# EAGLE design untitled (EAGLE 5.06)
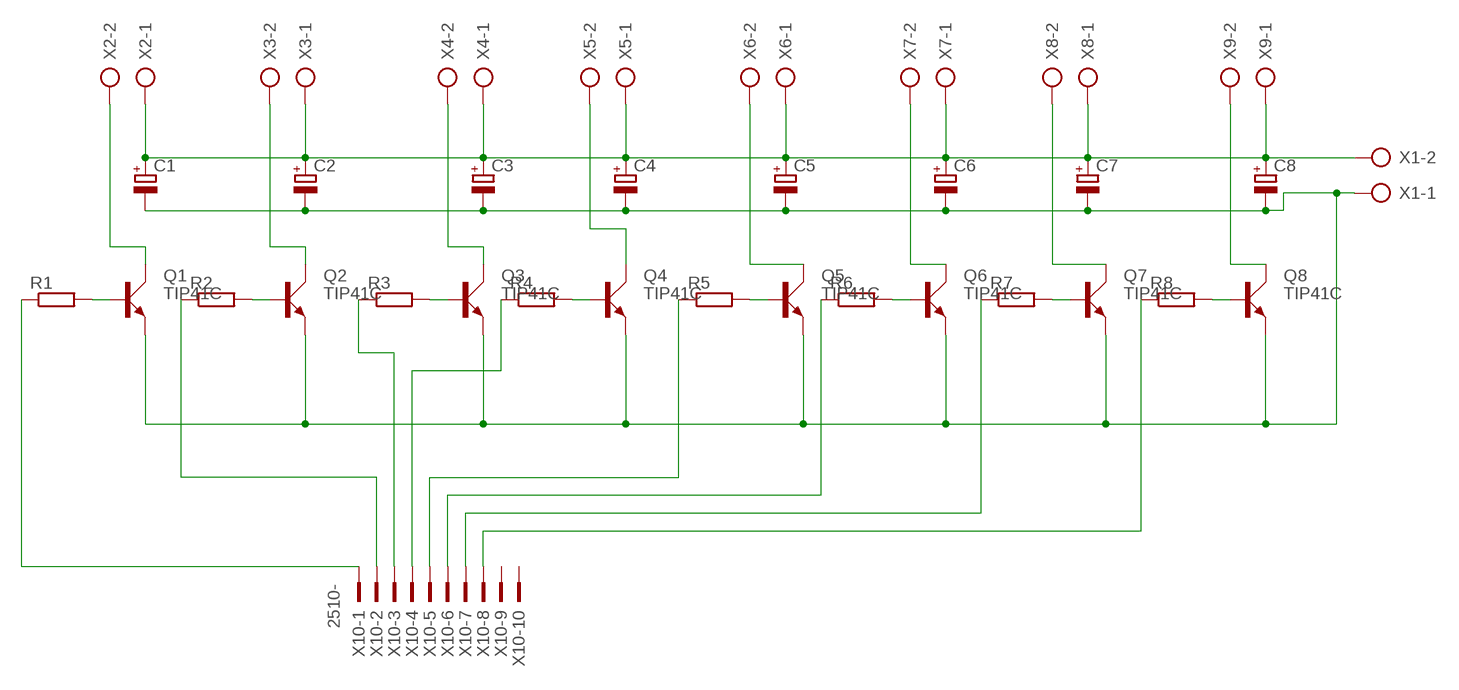
[diagram p0: schematic, sheet 1]

## Parts
C1  CPOL-EUE5-10.5  [E5-10,5]
C2  CPOL-EUE5-10.5  [E5-10,5]
C3  CPOL-EUE5-10.5  [E5-10,5]
C4  CPOL-EUE5-10.5  [E5-10,5]
C5  CPOL-EUE5-10.5  [E5-10,5]
C6  CPOL-EUE5-10.5  [E5-10,5]
C7  CPOL-EUE5-10.5  [E5-10,5]
C8  CPOL-EUE5-10.5  [E5-10,5]
Q1  TIP41C  [TO220AV]
Q2  TIP41C  [TO220AV]
Q3  TIP41C  [TO220AV]
Q4  TIP41C  [TO220AV]
Q5  TIP41C  [TO220AV]
Q6  TIP41C  [TO220AV]
Q7  TIP41C  [TO220AV]
Q8  TIP41C  [TO220AV]
R1  R-EU_0204/7  [0204/7]
R2  R-EU_0204/7  [0204/7]
R3  R-EU_0204/7  [0204/7]
R4  R-EU_0204/7  [0204/7]
R5  R-EU_0204/7  [0204/7]
R6  R-EU_0204/7  [0204/7]
R7  R-EU_0204/7  [0204/7]
R8  R-EU_0204/7  [0204/7]
X1  AK300/2  [AK300/2]
X2  AK300/2  [AK300/2]
X3  AK300/2  [AK300/2]
X4  AK300/2  [AK300/2]
X5  AK300/2  [AK300/2]
X6  AK300/2  [AK300/2]
X7  AK300/2  [AK300/2]
X8  AK300/2  [AK300/2]
X9  AK300/2  [AK300/2]
X10  2510-  [PAK100/2500-10]

## Nets
N$1: Q1.B R1.2
N$2: Q2.B R2.2
N$3: Q3.B R3.2
N$4: Q4.B R4.2
N$5: Q5.B R5.2
N$6: Q7.B R7.2
N$7: Q8.B R8.2
N$8: Q6.B R6.2
N$9: C1.- C2.- C3.- C4.- C5.- C6.- C7.- C8.- Q1.E Q2.E Q3.E Q4.E Q5.E Q6.E Q7.E Q8.E X1.1
N$10: Q1.C X2.2
N$11: Q2.C X3.2
N$12: Q3.C X4.2
N$13: Q4.C X5.2
N$14: Q5.C X6.2
N$15: Q6.C X7.2
N$16: Q7.C X8.2
N$17: Q8.C X9.2
N$18: C1.+ C2.+ C3.+ C4.+ C5.+ C6.+ C7.+ C8.+ X1.2 X2.1 X3.1 X4.1 X5.1 X6.1 X7.1 X8.1 X9.1
N$19: R3.1 X10.3
N$20: R4.1 X10.4
N$21: R1.1 X10.1
N$22: R2.1 X10.2
N$23: R5.1 X10.5
N$24: R6.1 X10.6
N$25: R7.1 X10.7
N$26: R8.1 X10.8
Unconnected: X10.9 X10.10

## Library data of the parts
C1-C8 = rcl:CPOL-EU: POLARIZED CAPACITOR, European symbol
Q1-Q8 = transistor-power:TIP41C: NPN TRANSISTOR
R1-R8 = rcl:R-EU_: RESISTOR, European symbol
X1-X9 = con-ptr500:AK300/2: CONNECTOR
X10 = con-3m:2510-: 3M (TM) Pak 100 4-Wall Header Source: 3M

## Board
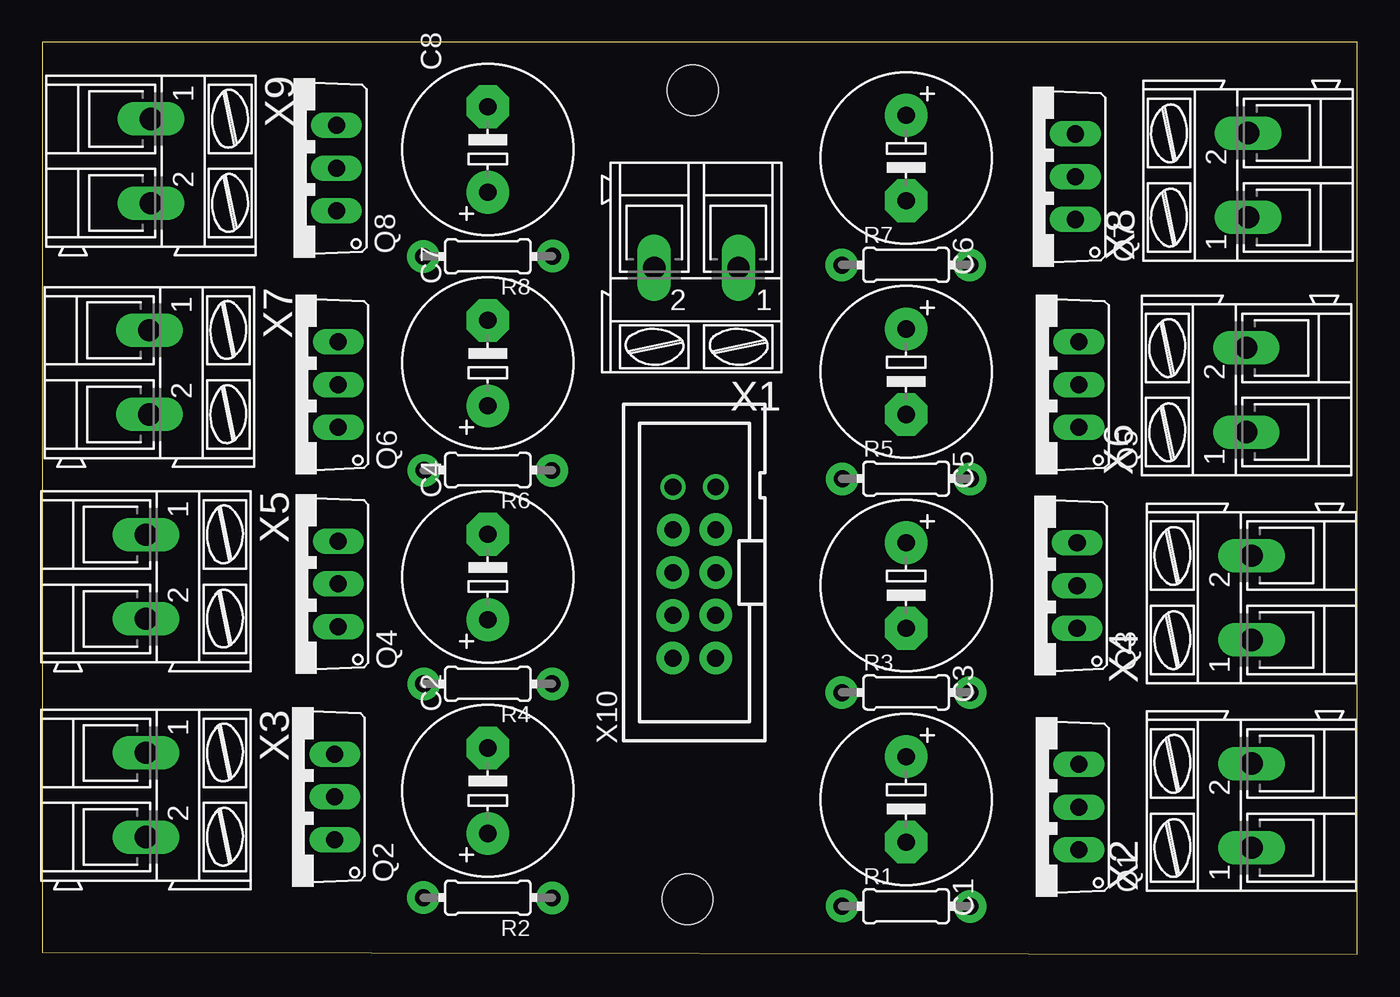
[diagram p1: board, top side]
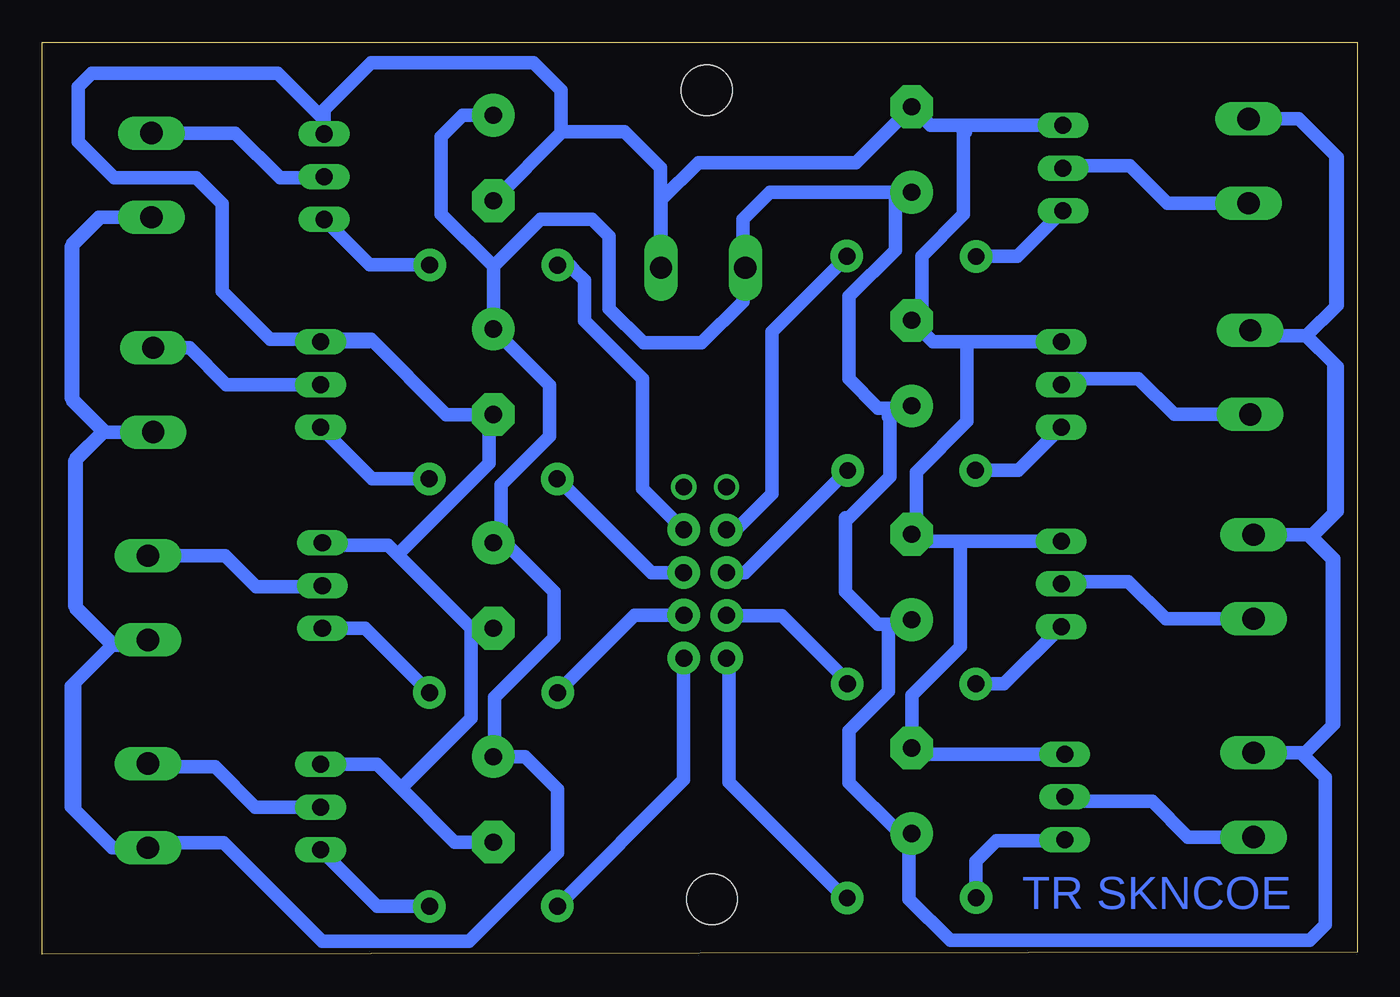
[diagram p2: board, bottom side, seen from below]

Size 78.17 x 54.18 mm. Coordinates in mm from the lower left corner, seen from the top.
Outline: 78.17,0 78.17,54.18 0,54.18 0,0.1 78.17,0
Copper layers (1*16): Top 0.035mm / dielectric 1.5mm / Bottom 0.035mm
Design rules "default": minimum track width 10mil, minimum drill 24mil, track to track 8mil, track to pad 8mil, pad to pad 8mil, via to via 8mil, smd to smd 8mil, copper to edge 40mil, drill to drill 8mil, minimum pad ring 10mil, minimum via ring 8mil, stop-mask expansion 4mil, vias tented up to drill 0mil, thermal gap 10mil
Holes 3 mm at 38.66,51.31 38.36,3.26

### Footprints (pad centres in the part's own frame; a part is rotated, then mirrored left to right if it is on the bottom)
E5-10,5 = drill 1.016 pad 2.54 round: + -2.54,0 | drill 1.016 pad 2.54 octagon: - 2.54,0
TO220AV = drill 1.016 long: B -2.54,-2.54; C 0,-2.54; E 2.54,-2.54
0204/7 = drill 0.813 octagon: 1 -3.81,0; 2 3.81,0
AK300/2 = drill 1.321 long: 1 -2.515,0; 2 2.489,0
PAK100/2500-10 = drill 1 pad 1.422 round: 1 -5.08,-1.27; 2 -5.08,1.27; 3 -2.54,-1.27; 4 -2.54,1.27; 5 0,-1.27; 6 0,1.27; 7 2.54,-1.27; 8 2.54,1.27; 9 5.08,-1.27; 10 5.08,1.27

### Placement (x,y rotation side)
C1  51.35,9.2 270 top
C2  26.49,9.71 90 top
C3  51.35,21.9 270 top
C4  26.49,22.41 90 top
C5  51.35,34.6 270 top
C6  51.35,47.3 270 top
C7  26.49,35.11 90 top
C8  26.49,47.81 90 top
Q1  59.07,8.73 90 top
Q2  14.86,9.34 90 top
Q3  58.97,21.9 90 top
Q4  15.06,22 90 top
Q5  59.07,33.84 90 top
Q6  15.06,33.84 90 top
Q7  58.87,46.18 90 top
Q8  14.96,46.69 90 top
R1  51.35,2.85 0 top
R2  26.49,3.36 180 top
R3  51.35,15.55 0 top
R4  26.49,16.06 180 top
R5  51.35,28.25 0 top
R6  26.49,28.76 180 top
R7  51.35,40.95 0 top
R8  26.49,41.46 180 top
X1  38.87,40.78 180 top
X2  71.87,8.83 90 top
X3  6.17,9.45 270 top
X4  71.87,21.18 90 top
X5  6.17,22.41 270 top
X6  71.57,33.53 90 top
X7  6.37,34.55 270 top
X8  71.67,46.29 90 top
X9  6.48,47.1 270 top
X10  38.77,22.67 90 top

### Tracks (layer width: path | path; a pad name or v marks a point on that pad's centre or on a via)
N$1
  Bottom 0.813: R1.2 58.27,2.85 Q1.B
N$2
  Bottom 0.813: R2.2 22.68,5.51 21.46,6.73 17.47,6.73 Q2.B
N$3
  Bottom 0.813: Q3.B 58.97,19.36 R3.2
N$4
  Bottom 0.813: R4.2 21,16.06 Q4.B
N$5
  Bottom 0.813: R5.2 58.56,28.25 Q5.B
N$6
  Bottom 0.813: R7.2 58.71,40.95 Q7.B
N$7
  Bottom 0.813: R8.2 20.2,41.46 Q8.B
N$8
  Bottom 0.813: R6.2 20.14,28.76 Q6.B
N$9
  Bottom 0.813: C1.- 53.65,6.66 56.84,9.85 | Q1.E 58.26,11.27 56.84,9.85 | 54.15,32.06 C5.- | 54.15,32.06 58.62,36.52 | Q5.E 58.76,36.38 58.62,36.52 | 61.41,49.58 61.41,50.16 58.62,52.94 48.95,52.94 47.32,51.31 47.32,48.79 | 61.41,49.58 Q7.E | 52.68,19.36 C3.- | 52.68,19.36 57.04,23.72 | 57.04,23.72 57.6,24.28 61.35,24.28 Q3.E | 54.15,32.06 51.72,32.06 51.59,31.93 51.59,29.17 57.04,23.72 | 52.68,19.36 52.68,14 56.84,9.85 | 23.7,49.23 23.2,49.23 | 23.2,49.23 Q8.E | 23.7,49.23 25.38,49.23 C8.- 29.81,47.03 39.17,47.03 41.38,44.82 X1.1 41.41,44.17 41.41,46.73 43.55,48.86 47.24,48.86 47.32,48.79 | 23.1,36.38 Q6.E | 23.1,36.38 25.22,36.38 C7.- 25.87,38.26 25.87,41.47 23.4,43.95 23.4,49.03 23.2,49.23 | 23.39,24.54 Q4.E | 23.39,24.54 26.08,24.54 C4.- 26.22,25.22 26.22,28.64 23.2,31.66 23.2,36.27 23.1,36.38 | Q2.E 26.13,11.88 C2.- 26.49,15.37 23.6,18.26 23.6,24.33 23.39,24.54 | 23.7,49.23 23.29,48.83 | 58.62,36.52 64.62,36.52 67.48,39.38 67.48,44.58 69,46.11 73.89,46.11 76.03,48.25 76.03,51.52 75.21,52.33 64.16,52.33 61.41,49.58 | 47.32,48.79 C6.-
N$10
  Bottom 0.813: Q1.C 65.5,8.73 67.88,11.12 71.67,11.12 X2.2
N$11
  Bottom 0.813: X3.2 10.07,6.96 12.19,9.08 17.13,9.08 Q2.C
N$12
  Bottom 0.813: X4.2 67.28,23.67 65.44,21.83 61.57,21.83 Q3.C
N$13
  Bottom 0.813: X5.2 11.4,19.92 13.62,22.14 17.46,22.14 Q4.C
N$14
  Bottom 0.813: Q5.C 67.24,33.84 69.41,36.01 X6.2
N$15
  Bottom 0.813: X7.2 10.89,32.06 13.01,34.17 17.26,34.17 Q6.C
N$16
  Bottom 0.813: X8.2 66.68,48.78 64.02,46.11 61.48,46.11 Q7.C
N$17
  Bottom 0.813: X9.2 11.31,44.61 13.52,46.82 17.37,46.82 Q8.C
N$18
  Bottom 0.813: 51.35,40.87 C5.+ 48.02,33.8 48.02,30.75 50.9,27.87 50.9,24.67 | C6.+ 53.17,49.84 54.44,48.56 54.44,43.97 51.35,40.87 | 73.99,18.36 76.23,16.12 76.23,8.57 73.98,6.32 X2.1 71.56,6.63 67.37,6.63 61.51,0.77 52.78,0.77 47.52,6.03 47.52,9.79 49.46,11.74 51.29,11.74 | 73.99,18.36 72.18,18.36 X4.1 | 74.5,31.01 74.6,31.01 76.13,29.48 76.13,20.5 73.99,18.36 | 74.5,31.01 X6.1 | 74.5,31.01 76.33,32.85 76.33,42.23 74.8,43.77 X8.1 74.69,43.77 76.44,42.03 76.44,33.05 74.5,31.11 74.5,31.01 76.23,29.28 76.23,20.7 73.99,18.46 73.99,18.36 76.44,15.91 76.44,8.77 73.99,6.32 | C3.+ 51.14,24.44 50.9,24.67 | 27.26,45.27 C8.+ | 3.48,49.62 X9.1 3.48,49.62 | 3.48,49.62 1.3,47.44 1.3,38.45 3.03,36.72 | 3.03,36.72 6.03,36.72 X7.1 | 2.83,24.92 2.6,24.92 1.2,26.32 1.2,34.89 3.03,36.72 | 2.83,24.92 X5.1 | X3.1 3.11,11.96 1.4,13.67 1.4,23.49 2.83,24.92 | 27.87,32.44 26.62,32.44 C7.+ | 27.87,32.44 28.48,32.44 30.21,34.17 30.21,39.08 27.46,41.82 27.46,45.06 27.26,45.27 | 27.97,19.59 26.77,19.59 C4.+ | 27.97,19.59 28.48,19.59 30.42,21.52 30.42,25.91 30.22,25.91 27.77,28.36 27.77,31.83 27.87,31.93 27.87,32.44 | 27.97,19.59 27.87,19.48 27.87,15.61 30.21,13.27 30.21,10.2 27.36,7.34 26.67,7.34 C2.+ 26.45,7.12 26.45,6.63 26.65,6.43 26.65,3.26 24.2,0.82 2.83,0.82 1.91,1.73 1.91,10.51 3.13,11.73 3.13,11.93 1.5,13.56 1.5,23.46 2.72,24.68 2.72,24.89 1.3,26.32 1.4,26.42 1.4,35.09 3.03,36.72 | 51.35,40.87 48.56,43.66 45.49,43.66 44.47,42.64 44.47,38.35 42.43,36.32 38.97,36.32 36.53,38.76 36.53,40.63 X1.2 36.53,40.92 36.53,43.66 34.92,45.27 27.26,45.27 | 51.29,11.74 C1.+ | 3.48,49.62 1.2,47.33 1.2,38.56 3.03,36.72
  Bottom 0.813: 51.29,11.74 51.29,15.27 47.76,18.8 47.76,21.53 50.9,24.67
N$19
  Bottom 0.813: X10.3 42.96,20.13 R3.1
N$20
  Bottom 0.813: R4.1 30.3,16.21 34.18,20.1 37.47,20.1 X10.4
N$21
  Bottom 0.813: X10.1 40.04,10.35 R1.1
N$22
  Bottom 0.813: R2.1 30.5,3.36 37.34,10.2 37.34,17.43 X10.2
N$23
  Bottom 0.813: X10.5 41.96,22.67 R5.1
N$24
  Bottom 0.813: X10.6 36.39,22.67 R6.1
N$25
  Bottom 0.813: X10.7 42.47,27.64 42.47,34.18 45.94,37.64 45.94,40.02 46.54,40.63 46.86,40.95 R7.1
N$26
  Bottom 0.813: X10.8 36.93,25.21 34.8,27.34 34.8,36.96 R8.1 30.36,41.52
N$30  (via drill 1 pad 1.93)
  other vias: 22.7,28.74
N$35  (via drill 1 pad 1.93)
  other vias: 30.34,41.46
N$36  (via drill 1 pad 1.93)
  other vias: 30.29,28.73
N$37  (via drill 1 pad 1.93)
  other vias: 22.68,16.05
N$38  (via drill 1 pad 1.93)
  other vias: 30.31,16.05
N$39  (via drill 1 pad 1.93)
  other vias: 22.66,3.35
N$40  (via drill 1 pad 1.93)
  other vias: 47.56,28.24
N$43  (via drill 1 pad 1.93)
  other vias: 47.53,40.93
N$44  (via drill 1 pad 1.93)
  other vias: 55.13,40.94
N$45  (via drill 1 pad 1.93)
  other vias: 55.17,28.23
N$46  (via drill 1 pad 1.93)
  other vias: 55.14,15.54
N$47  (via drill 1 pad 1.93)
  other vias: 55.14,2.84
N$48  (via drill 1 pad 1.93)
  other vias: 47.54,2.85
N$49  (via drill 1 pad 1.93)
  other vias: 47.53,15.54
N$50  (via drill 1 pad 1.93)
  other vias: 22.66,41.44
N$51  (via drill 1 pad 1.93)
  other vias: 30.32,3.33
N$52  (via drill 1 pad 1.93)
  other vias: 37.49,17.58
N$53  (via drill 1 pad 1.93)
  other vias: 40.03,17.58
N$54  (via drill 1 pad 1.93)
  other vias: 40.03,20.14
N$55  (via drill 1 pad 1.93)
  other vias: 37.49,20.13
N$56  (via drill 1 pad 1.93)
  other vias: 40.04,22.67
N$57  (via drill 1 pad 1.93)
  other vias: 37.49,22.67
N$58  (via drill 1 pad 1.93)
  other vias: 40.04,25.21
N$59  (via drill 1 pad 1.93)
  other vias: 37.5,25.2

### Text on the board
Bottom: TR SKNCOE